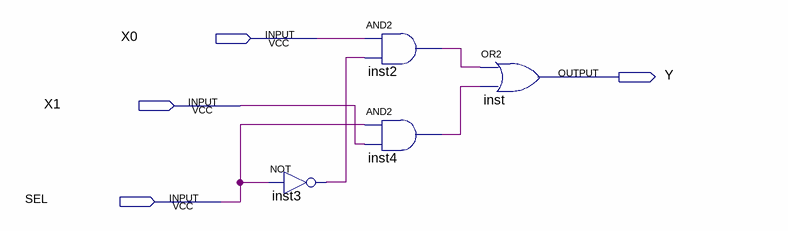
[diagram p0: schematic sheet]
// Quartus schematic Mux2_1.bdf as structural Verilog: 4 symbols, 4 pins
module Mux2_1 (
  input  X0,
  input  X1,
  input  SEL,
  output Y
);

  wire inst2_out, inst3_out, inst4_out;

  not inst3 (inst3_out, SEL);
  and inst2 (inst2_out, X0, inst3_out);
  and inst4 (inst4_out, SEL, X1);
  or inst (Y, inst2_out, inst4_out);
endmodule
